# Altium schematic sheet Adafruit 2.7in Sharp Memory Display.SchDoc
size 282 x 200 mm; CHECKED: KTOWN; COMPANY: ADAFRUIT INDUSTRIES; DRAWN: KTOWN; REV: A; YEAR: >YEAR; DRGNO: >DRGNO
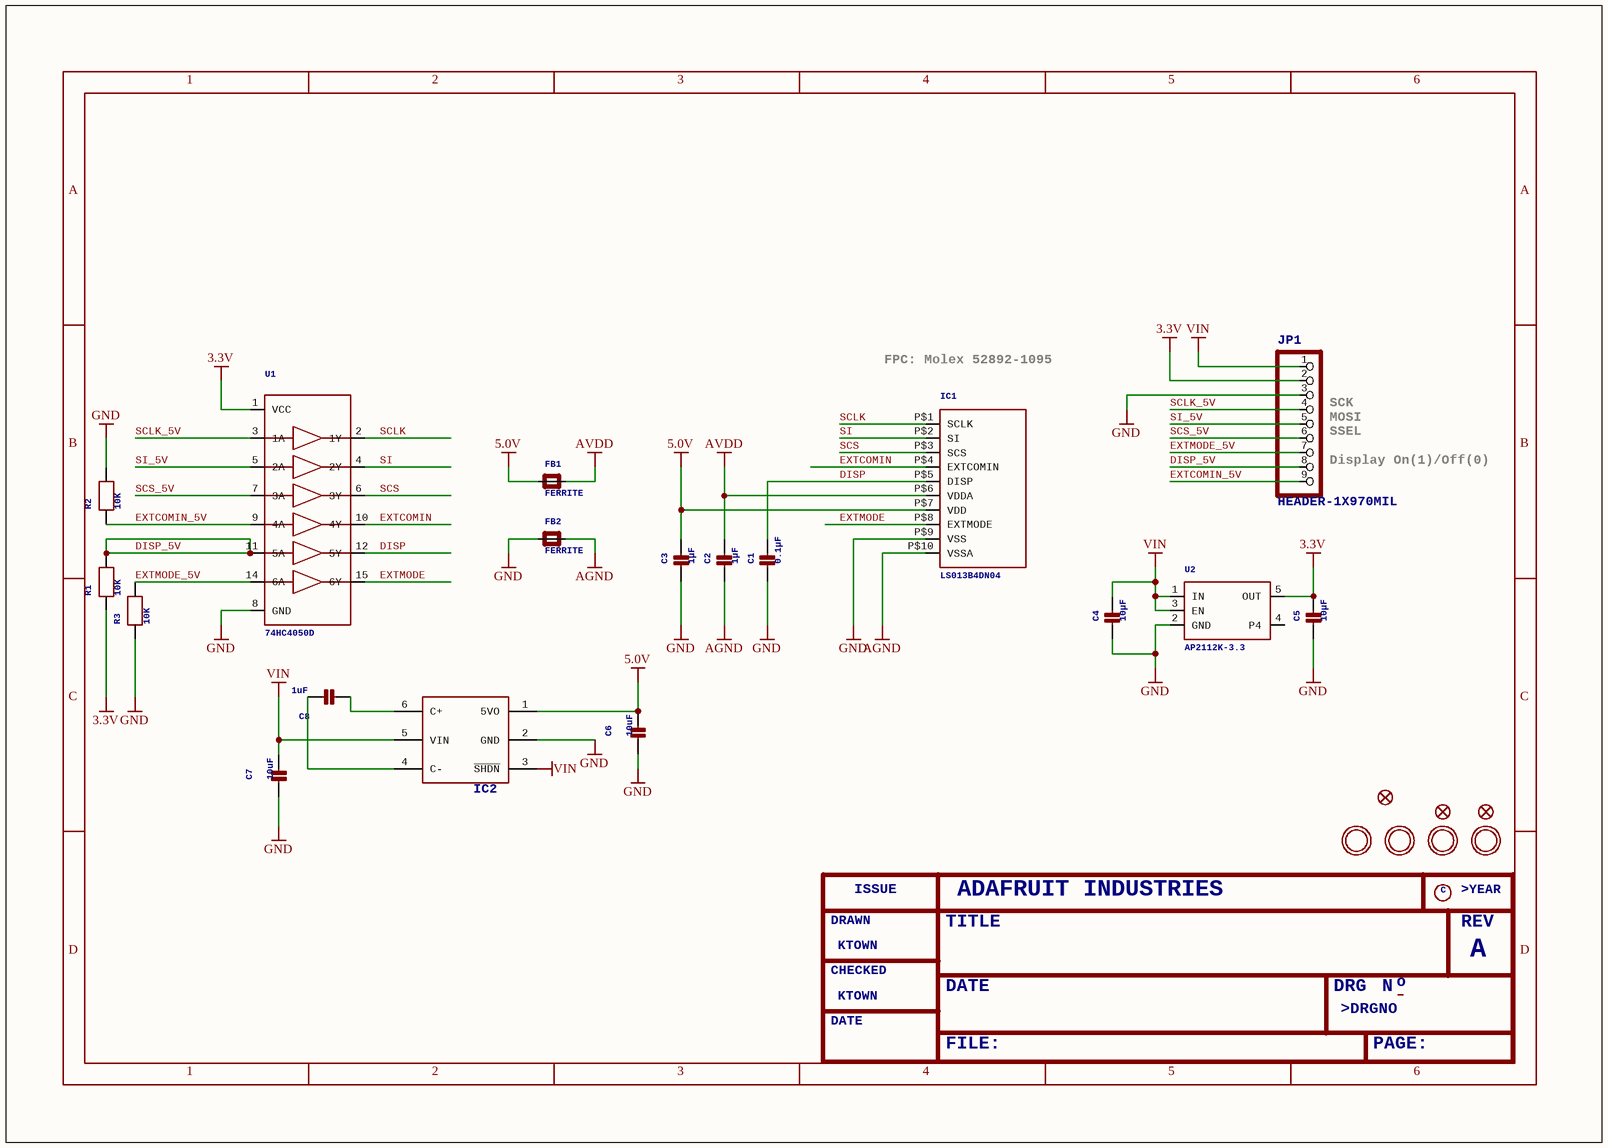
[diagram p0: Adafruit 2.7in Sharp Memory Display.SchDoc]

## Parts
C1  0.1µF  [0603-NO]
C2  1µF  [0805_10MGAP]
C3  1µF  [0805-NO]
C4  10µF  [0805-NO]
C5  10µF  [0805-NO]
C6  10uF  [0805-NO]
C7  10uF  [0805-NO]
C8  1uF  [0805-NO]
FB1  FERRITE  [_0805]
FB2  FERRITE  [_0805]
FID1  FIDUCIAL_1MM  [FIDUCIAL_1MM]  (value not drawn)
FID2  FIDUCIAL_1MM  [FIDUCIAL_1MM]  (value not drawn)
FID3  FIDUCIAL_1MM  [FIDUCIAL_1MM]  (value not drawn)
IC1  LS013B4DN04  [SHARP_2.7IN]
IC2  AP3602  [SOT23-6]  (value not drawn)
JP1  HEADER-1X970MIL  [1X09_ROUND_70]
R1  10K  [0603-NO]
R2  10K  [0603-NO]
R3  10K  [0603-NO]
U1  74HC4050D  [SOIC16]
U2  AP2112K-3.3  [SOT23-5]
U$21  MOUNTINGHOLE2.5_THICK  [MOUNTINGHOLE_2.5_PLATED_THICK]  (value not drawn)
U$22  MOUNTINGHOLE2.5_THICK  [MOUNTINGHOLE_2.5_PLATED_THICK]  (value not drawn)
U$27  MOUNTINGHOLE2.5  [MOUNTINGHOLE_2.5_PLATED]  (value not drawn)
U$28  MOUNTINGHOLE2.5  [MOUNTINGHOLE_2.5_PLATED]  (value not drawn)

## Nets
3.3V: C5.1 JP1.2 R1.1 U1.1(VCC) U2.5(OUT)
5.0V: C3.1 C6.1 FB1.1(P$1) IC1.P$7(VDD) IC2.1(5VO)
AGND: C2.2 FB2.2(P$2) IC1.P$10(VSSA)
AVDD: C2.1 FB1.2(P$2) IC1.P$6(VDDA)
GND: C1.2 C3.2 C4.2 C5.2 C6.2 C7.2 FB2.1(P$1) IC1.P$9(VSS) IC2.2(GND) JP1.3 R2.2 R3.1 U1.8(GND) U2.2(GND)
VIN: C4.1 C7.1 IC2.3(~{SHDN}) IC2.5(VIN) JP1.1 U2.1(IN) U2.3(EN)
DISP: C1.1 IC1.P$5(DISP) U1.12(5Y)
DISP_5V: JP1.8 R1.2 U1.11(5A)
EXTCOMIN: IC1.P$4(EXTCOMIN) U1.10(4Y)
EXTCOMIN_5V: JP1.9 R2.1 U1.9(4A)
EXTMODE: IC1.P$8(EXTMODE) U1.15(6Y)
EXTMODE_5V: JP1.7 R3.2 U1.14(6A)
SCLK: IC1.P$1(SCLK) U1.2(1Y)
SCLK_5V: JP1.4 U1.3(1A)
SCS: IC1.P$3(SCS) U1.6(3Y)
SCS_5V: JP1.6 U1.7(3A)
SI: IC1.P$2(SI) U1.4(2Y)
SI_5V: JP1.5 U1.5(2A)
NetC8_1: C8.1 IC2.4(C-)
NetC8_2: C8.2 IC2.6(C+)

Not connected (* = marked no-connect by the designer): U2 4(P4)

## Notes on the sheet
- (near IC1) FPC: Molex 52892-1095
- (near JP1) SSEL
- (near JP1) MOSI
- (near JP1) SCK
- (near JP1) Display On(1)/Off(0)
- DRAWN
- KTOWN
- ISSUE
- TITLE
- ADAFRUIT INDUSTRIES
- C
- REV
- >YEAR
- CHECKED
- DATE
- DRG
- >DRGNO
- N
- o
- A
- FILE:
- PAGE:
- 1
- 2
- 3
- 4
- 5
- 6
- B
- D

## Library data of the parts
C1 = CAP_CERAMIC0603_NO: Ceramic Capacitors   For new designs, use the packages preceded by an '_' character since they are more reliable:   The following footprints should be used on most boards: _0402 - Standard footprint for regular board layouts  _0603 - Standard footprint for regular board layouts  _0805 - Standard footprint for regular board layouts  _1206 - Standard footprint for regular board layouts       For extremely tight-pitch boards where space is at a premium, the following 'micro-pitch' footprints can be used (smaller pads, no silkscreen outline, etc.): _0402MP - Micro-pitch footprint for very dense/compact boards  _0603MP - Micro-pitch footprint for very dense/compact boards  _0805MP - Micro-pitch footprint for very dense/compact boards  _1206MP - Micro-pitch footprint for very dense/compact boards
C2 = CAP_CERAMIC0805_10MGAP: Ceramic Capacitors   For new designs, use the packages preceded by an '_' character since they are more reliable:   The following footprints should be used on most boards: _0402 - Standard footprint for regular board layouts  _0603 - Standard footprint for regular board layouts  _0805 - Standard footprint for regular board layouts  _1206 - Standard footprint for regular board layouts       For extremely tight-pitch boards where space is at a premium, the following 'micro-pitch' footprints can be used (smaller pads, no silkscreen outline, etc.): _0402MP - Micro-pitch footprint for very dense/compact boards  _0603MP - Micro-pitch footprint for very dense/compact boards  _0805MP - Micro-pitch footprint for very dense/compact boards  _1206MP - Micro-pitch footprint for very dense/compact boards
C3-C8 = CAP_CERAMIC0805-NOOUTLINE: Ceramic Capacitors   For new designs, use the packages preceded by an '_' character since they are more reliable:   The following footprints should be used on most boards: _0402 - Standard footprint for regular board layouts  _0603 - Standard footprint for regular board layouts  _0805 - Standard footprint for regular board layouts  _1206 - Standard footprint for regular board layouts       For extremely tight-pitch boards where space is at a premium, the following 'micro-pitch' footprints can be used (smaller pads, no silkscreen outline, etc.): _0402MP - Micro-pitch footprint for very dense/compact boards  _0603MP - Micro-pitch footprint for very dense/compact boards  _0805MP - Micro-pitch footprint for very dense/compact boards  _1206MP - Micro-pitch footprint for very dense/compact boards
FB1 FB2 = FERRITE_0805: Ferrite Bead   0603 MMZ1608B121C - 120 Ohm @ 100MHz, 600mA, 0.15 Ohm DC Resistance - Digikey: 445-2164-1-ND  BK1608HW121-T - 120 Ohm, 600mA Ferrite Chip - Digikey: 587-1876-2-ND       0805 HZ0805B272R-10 - 2.7K Ohm @ 100MHz, 200mA, 0.8 Ohm DC Resistance - Digikey: 240-2504-1-ND (see also Murata BLM21BD272SN1L)  MMZ2012Y152B - 1.5K Ohm @ 100MHz, 500mA, 0.4 Ohm DC Resistance - Digikey: 445-1560-1-ND - Mainly for high frequency (80-400MHz)  MMZ2012R102A - 1K Ohm @ 100MHz, 500mA, 0.3 Ohm DC Resistance - Digikey: 445-1555-2-ND - More general purpose (10-200MHz)
FID1-FID3 = FIDUCIAL_1MM: Fiducial Alignment Points   Various fiducial points for machine vision alignment.
IC1 = DISP_EINK_SHARPMEMORYLCD_10PIN_27IN: Sharp Mono Memory LCD   LS013B4DN04 - 1.35" 96x96 Pixels   LS027B7DH01 - 2.7" 400x240 Pixels   FPC Connector: Molex 52892-1095 (WM9203CT-ND)
JP1 = HEADER-1X970MIL: PIN HEADER
R1-R3 = RESISTOR_0603_NOOUT: Resistors   For new designs, use the packages preceded by an '_' character since they are more reliable:   The following footprints should be used on most boards: _0402 - Standard footprint for regular board layouts  _0603 - Standard footprint for regular board layouts  _0805 - Standard footprint for regular board layouts  _1206 - Standard footprint for regular board layouts       For extremely tight-pitch boards where space is at a premium, the following 'micro-pitch' footprints can be used (smaller pads, no silkscreen outline, etc.): _0402MP - Micro-pitch footprint for very dense/compact boards  _0603MP - Micro-pitch footprint for very dense/compact boards  _0805MP - Micro-pitch footprint for very dense/compact boards  _1206MP - Micro-pitch footprint for very dense/compact boards
U1 = 74HC4050D: 6-channel level shifter    74HC4050D - 2V-6V Supply   SOIC16 Digikey: 74HC4050D,653-ND  Mouser: 771-74HC4050D-T        TSSOP16 Digikey: 296-9215-1-ND  Mouser:
U2 = VREG_SOT23-5: SOT23-5 Fixed Voltage Regulators      Part	Current Out	V Out	V In	V Dropout	胃JA (掳C/W)	TJ (掳C)	Digikey Part No.	     ADP121	  150mA	  3.3V	  3.4-5.5V	  0.09V @ 150mA	  --	  --	  ADP121-AUJZ33R7CT-ND	     ADP121	  150mA	  3.0V	  3.1-5.5V	  0.09V @ 150mA	  --	  --	  ADP121-AUJZ30R7CT-ND	     ADP122	  300mA	  3.3V	  3.4-5.5V	  0.085V @ 300mA	  --	  --	  ADP122AUJZ-3.3-R7CT-ND	     ADP1712	  300mA	  3.3V	  3.5-5.5V	  0.17V @ 300mA	  --	  --	  ADP1712AUJZ-3.3-R7TR-ND	     AP7311 (Low Cost)	  150mA	  3.3V	  3.5-6V	  0.15V @ 150mA	  --	  --	  AP7311-33WG-7DICT-ND	     LD39015M18R	  150mA	  1.8V	  1.9V-5.5V	  0.08V @ 100mA	  --	  --	  497-6977-1-ND	     LP2985A-33DBVR	  150mA	  3.3V	  3.3-16V	  0.28V @ 150mA	  206	  150	  296-18479-1-ND	     MCP1824T-3302E/OT	  300mA	  3.3V	  3.5V-6V	  0.2V @ 300mA	  --	  --	  MCP1824T-3302E/OTCT-ND	     MIC5205-2.5YM5 TR	  150mA	  2.5V	  2.7-16V	  0.165V @ 150mA	  --	  --	  576-1257-2-ND	     MIC5205-3.0YM5 TR	  150mA	  3.0V	  3.2V-16V	  0.165V @ 150mA	  --	  --	  576-1258-2-ND	     MIC5205-3.3YM5 TR	  150mA	  3.3V	  3.5V-16V	  0.165V @ 150mA	  --	  --	  576-1259-2-ND	     TPS780330220	  150mA	  3.3V+2.2V	  3.6-5.5V	  250mV Max	  --	  --	  296-23332-1-ND	     TDA3663/N1,135	  100mA	  3.3V	  3.5-45V	  0.18V @ 50mA	  --	  --	  568-5343-1-ND	     	  	  	  	  	  	  	  	     	  	  	  	  	  	  	  	   Max operating temp can be calculated using 胃JA, TJ (max junction temperature), and power in watts.  Set the "Maximum Ambient Temperature" until it reaches TJ ("Max Junction Temperature"), which is the absolute limit for safe use of the regulator: Heat Sink Temperature Calculator   For example, With 12V source into a 3.3V LP2985 and a 30mA load, we are dissipating (12V-3.3V) * 0.03A = 0.261W.  With a 胃JA of 206 掳C/W, a TJ of 150掳C, and 261mW we can safely use the chip without a heat sink up to 75掳C (=147.1掳C Junction Temperature).
U$21 U$22 = MOUNTINGHOLE2.5_THICK: Mounting Hole   For #2 screws (0.086"/2.18mm width, 0.094"/2.4mm hole) use 2.5mm
U$27 U$28 = MOUNTINGHOLE2.5: Mounting Hole   For #2 screws (0.086"/2.18mm width, 0.094"/2.4mm hole) use 2.5mm